# Altium schematic sheet LB-word-topLevel.SchDoc
size A
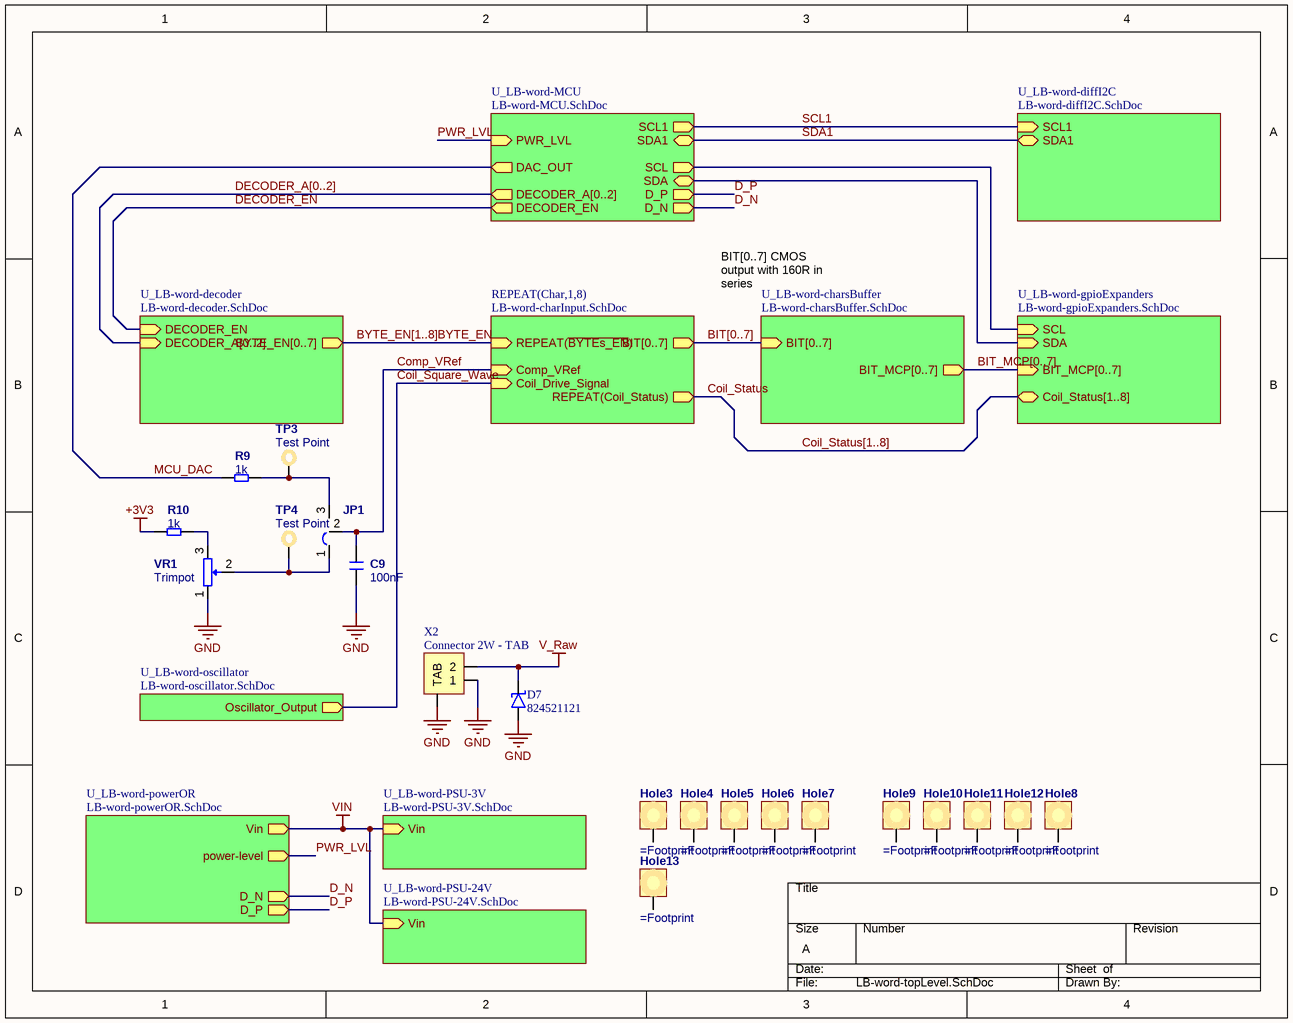
[diagram p0: LB-word-topLevel.SchDoc]

## Parts
C9  100nF  [C0603_N]
D7  824521121  [DO214AC SMA]
Hole3  (no value)  [M3 Plated Hole]
Hole4  (no value)  [M3 Plated Hole]
Hole5  (no value)  [M3 Plated Hole]
Hole6  (no value)  [M3 Plated Hole]
Hole7  (no value)  [M3 Plated Hole]
Hole8  (no value)  [M3 Plated Hole]
Hole9  (no value)  [M3 Plated Hole]
Hole10  (no value)  [M3 Plated Hole]
Hole11  (no value)  [M3 Plated Hole]
Hole12  (no value)  [M3 Plated Hole]
Hole13  (no value)  [M3 Plated Hole]
JP1  Jumper 3W  [Jumper SMD 3W NO]  (value not drawn)
R9  1k  [R0603]
R10  1k  [R0603]
TP3  Test Point  [TestPoint-1.2mm]
TP4  Test Point  [TestPoint-1.2mm]
VR1  Trimpot  [Trimpot 3314]
X2  Connector 2W - TAB  [PTSM-2W-H-SMD]

## Sub-sheets
REPEAT(Char,1,8) = LB-word-charInput.SchDoc: BIT[0..7] (out), Comp_VRef (in), REPEAT(~{BYTEs_EN}) (in), REPEAT(Coil_Status) (out), Coil_Drive_Signal (in)
U_LB-word-charsBuffer = LB-word-charsBuffer.SchDoc: BIT[0..7] (in), BIT_MCP[0..7] (out)
U_LB-word-decoder = LB-word-decoder.SchDoc: BYTE_EN[0..7] (out), DECODER_A[0..2] (in), DECODER_EN (in)
U_LB-word-diffI2C = LB-word-diffI2C.SchDoc: SDA1 (bidir), SCL1 (in)
U_LB-word-gpioExpanders = LB-word-gpioExpanders.SchDoc: SCL (in), SDA (in), BIT_MCP[0..7] (in), Coil_Status[1..8] (bidir)
U_LB-word-MCU = LB-word-MCU.SchDoc: SDA (bidir), SCL (out), DAC_OUT (out), DECODER_A[0..2] (out), DECODER_EN (out), D_P (out), D_N (out), SCL1 (out), SDA1 (bidir), PWR_LVL (in)
U_LB-word-oscillator = LB-word-oscillator.SchDoc: Oscillator_Output (out)
U_LB-word-powerOR = LB-word-powerOR.SchDoc: Vin (out), power-level (out), D_N (out), D_P (out)
U_LB-word-PSU-3V = LB-word-PSU-3V.SchDoc: Vin (in)
U_LB-word-PSU-24V = LB-word-PSU-24V.SchDoc: Vin (in)

## Nets
+3V3: R10.1
GND: C9.2 D7.A VR1.1 X2.1 X2.TAB
V_Raw: D7.K X2.2
VIN: sheet U_LB-word-PSU-3V/Vin, sheet U_LB-word-powerOR/Vin, sheet U_LB-word-PSU-24V/Vin
BYTE_EN: sheet REPEAT(Char,1,8)/REPEAT(~{BYTEs_EN})
Coil_Square_Wave: sheet REPEAT(Char,1,8)/Coil_Drive_Signal, sheet U_LB-word-oscillator/Oscillator_Output
Coil_Status: sheet REPEAT(Char,1,8)/REPEAT(Coil_Status)
Comp_VRef: C9.1 JP1.2 ; sheet REPEAT(Char,1,8)/Comp_VRef
D_N: sheet U_LB-word-powerOR/D_N, sheet U_LB-word-MCU/D_N
D_P: sheet U_LB-word-powerOR/D_P, sheet U_LB-word-MCU/D_P
DECODER_EN: sheet U_LB-word-decoder/DECODER_EN, sheet U_LB-word-MCU/DECODER_EN
MCU_DAC: R9.1 ; sheet U_LB-word-MCU/DAC_OUT
PWR_LVL: sheet U_LB-word-powerOR/power-level, sheet U_LB-word-MCU/PWR_LVL
SCL1: sheet U_LB-word-MCU/SCL1, sheet U_LB-word-diffI2C/SCL1
SDA1: sheet U_LB-word-MCU/SDA1, sheet U_LB-word-diffI2C/SDA1
NetJP1_1: JP1.1 TP4.1 VR1.2
NetJP1_3: JP1.3 R9.2 TP3.1
NetR10_2: R10.2 VR1.3
(unnamed): sheet U_LB-word-gpioExpanders/SCL, sheet U_LB-word-MCU/SCL
(unnamed): sheet U_LB-word-gpioExpanders/SDA, sheet U_LB-word-MCU/SDA

Not connected (* = marked no-connect by the designer): Hole3 1; Hole4 1; Hole5 1; Hole6 1; Hole7 1; Hole8 1; Hole9 1; Hole10 1; Hole11 1; Hole12 1; Hole13 1

## Buses and harness runs
bus BIT[0..7] = sheet REPEAT(Char,1,8)/BIT[0..7] = sheet U_LB-word-charsBuffer/BIT[0..7]
bus BIT_MCP[0..7] = sheet U_LB-word-charsBuffer/BIT_MCP[0..7] = sheet U_LB-word-gpioExpanders/BIT_MCP[0..7]
bus BYTE_EN[1..8] = sheet U_LB-word-decoder/BYTE_EN[0..7]
bus Coil_Status[1..8] = sheet U_LB-word-gpioExpanders/Coil_Status[1..8]
bus DECODER_A[0..2] = sheet U_LB-word-decoder/DECODER_A[0..2] = sheet U_LB-word-MCU/DECODER_A[0..2]

## Notes on the sheet
- BIT[0..7] CMOS output with 160R in series

## Library data of the parts
C9 = Capacitor: Capacitor MLCC; Manufacturer: Yageo; Manufacturer Part Number: CC0603KRX7R9BB104; Tolerance (%): 10; Category: Capacitor; Package: 0603; Value: 100nF; Supplier Part Number 1: 1362556; Supplier 1: Farnell; ComponentLink1URL: http://www.yageo.com; ComponentLink1Description: Manufacturer Website; Voltage Rating (Volts): *; Supplier 2: Digi-Key; Supplier Part Number 2: 311-1344-1-ND
D7 = TVS
Hole3-Hole13 = Hole: Footprint: =Footprint
R9 R10 = Resistor: Published: 17-Dec-2003; LatestRevisionDate: 19-Mar-2004; LatestRevisionNote: Silkscreen size reduced.; PackageDocument: Mar-2003; PackageReference: 3-0603; Publisher: Altium Limited; Code_IPC: 1608 [0603]; ComponentLink1Description: Manufacturer Link; ComponentLink1URL: http://www.panasonic.com/industrial/components/resistive_products.htm; ComponentLink2Description: Datasheet; ComponentLink2URL: http://www.panasonic.com/industrial/components/pdf/AOA0000CE2.pdf; Value: 1k